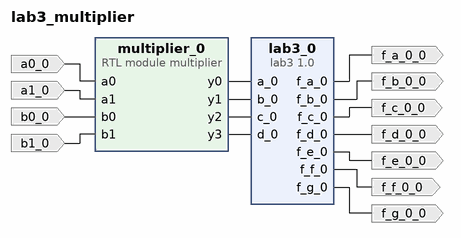
[diagram p0: block diagram of the top level]
# Vivado block design lab3_multiplier, xc7a35tcpg236-1, Vivado 2018.2
create_bd_design lab3_multiplier

create_bd_port -dir I a0_0
create_bd_port -dir I a1_0
create_bd_port -dir I b0_0
create_bd_port -dir I b1_0
create_bd_port -dir O f_a_0_0
create_bd_port -dir O f_b_0_0
create_bd_port -dir O f_c_0_0
create_bd_port -dir O f_d_0_0
create_bd_port -dir O f_e_0_0
create_bd_port -dir O f_f_0_0
create_bd_port -dir O f_g_0_0

create_bd_cell -type module -reference multiplier multiplier_0
create_bd_cell -type ip -vlnv user.org:user:lab3:1.0 lab3_0

# ---- connections ----

connect_bd_net -net a0_0_1 [get_bd_ports a0_0] [get_bd_pins multiplier_0/a0]
connect_bd_net -net a1_0_1 [get_bd_ports a1_0] [get_bd_pins multiplier_0/a1]
connect_bd_net -net b0_0_1 [get_bd_ports b0_0] [get_bd_pins multiplier_0/b0]
connect_bd_net -net b1_0_1 [get_bd_ports b1_0] [get_bd_pins multiplier_0/b1]
connect_bd_net [get_bd_pins multiplier_0/y0] [get_bd_pins lab3_0/a_0]
connect_bd_net [get_bd_pins multiplier_0/y1] [get_bd_pins lab3_0/b_0]
connect_bd_net [get_bd_pins multiplier_0/y2] [get_bd_pins lab3_0/c_0]
connect_bd_net [get_bd_pins multiplier_0/y3] [get_bd_pins lab3_0/d_0]
connect_bd_net [get_bd_pins lab3_0/f_a_0] [get_bd_ports f_a_0_0]
connect_bd_net [get_bd_pins lab3_0/f_b_0] [get_bd_ports f_b_0_0]
connect_bd_net [get_bd_pins lab3_0/f_c_0] [get_bd_ports f_c_0_0]
connect_bd_net [get_bd_pins lab3_0/f_d_0] [get_bd_ports f_d_0_0]
connect_bd_net [get_bd_pins lab3_0/f_e_0] [get_bd_ports f_e_0_0]
connect_bd_net [get_bd_pins lab3_0/f_f_0] [get_bd_ports f_f_0_0]
connect_bd_net [get_bd_pins lab3_0/f_g_0] [get_bd_ports f_g_0_0]

validate_bd_design
save_bd_design
